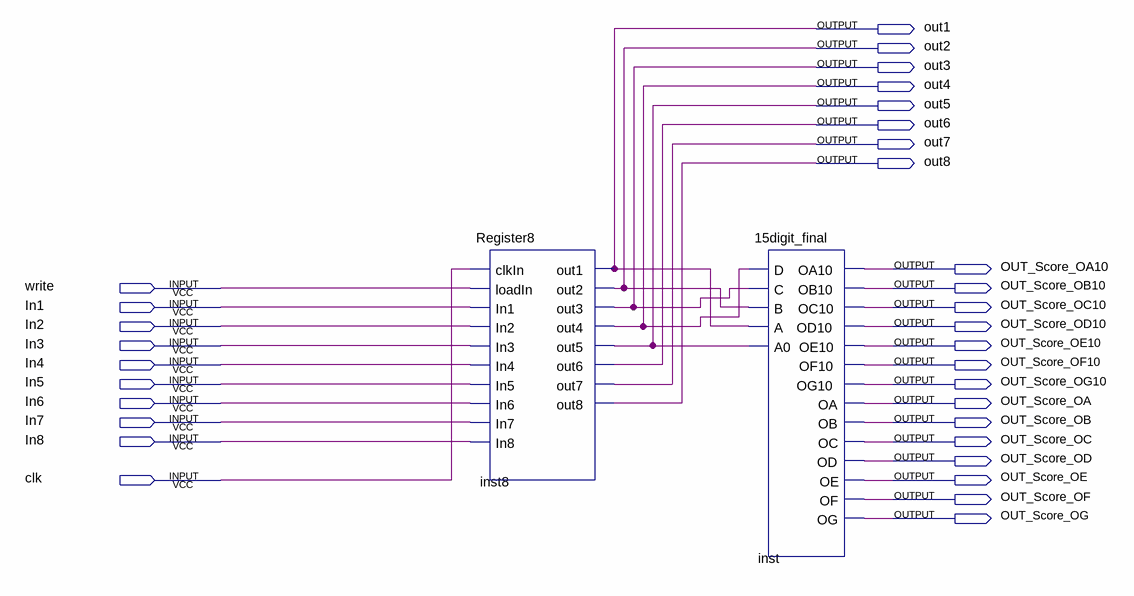
[diagram p0: schematic sheet]
// Quartus schematic OUTPUT_score.bdf as structural Verilog: 2 symbols, 32 pins
module OUTPUT_score (
  input  write,
  input  In1,
  input  In2,
  input  In3,
  input  In4,
  input  In5,
  input  In6,
  input  In7,
  input  In8,
  input  clk,
  output out1,
  output out2,
  output out3,
  output out4,
  output out5,
  output out6,
  output out7,
  output out8,
  output OUT_Score_OA10,
  output OUT_Score_OB10,
  output OUT_Score_OC10,
  output OUT_Score_OD10,
  output OUT_Score_OE10,
  output OUT_Score_OF10,
  output OUT_Score_OG10,
  output OUT_Score_OA,
  output OUT_Score_OB,
  output OUT_Score_OC,
  output OUT_Score_OD,
  output OUT_Score_OE,
  output OUT_Score_OF,
  output OUT_Score_OG
);

  Register8 inst8 (
    .clkIn(clk), .loadIn(write), .In1(In1), .In2(In2), .In3(In3), .In4(In4), .In5(In5), .In6(In6), .In7(In7),
    .In8(In8), .out1(out1), .out2(out2), .out3(out3), .out4(out4), .out5(out5), .out6(out6), .out7(out7),
    .out8(out8));
  \15digit_final  inst (
    .D(out4), .C(out3), .B(out2), .A(out1), .A0(out5), .OA10(OUT_Score_OA10), .OB10(OUT_Score_OB10),
    .OC10(OUT_Score_OC10), .OD10(OUT_Score_OD10), .OE10(OUT_Score_OE10), .OF10(OUT_Score_OF10),
    .OG10(OUT_Score_OG10), .OA(OUT_Score_OA), .OB(OUT_Score_OB), .OC(OUT_Score_OC), .OD(OUT_Score_OD),
    .OE(OUT_Score_OE), .OF(OUT_Score_OF), .OG(OUT_Score_OG));
endmodule
